# Altium schematic sheet RC_Sheet1.SchDoc
size A4
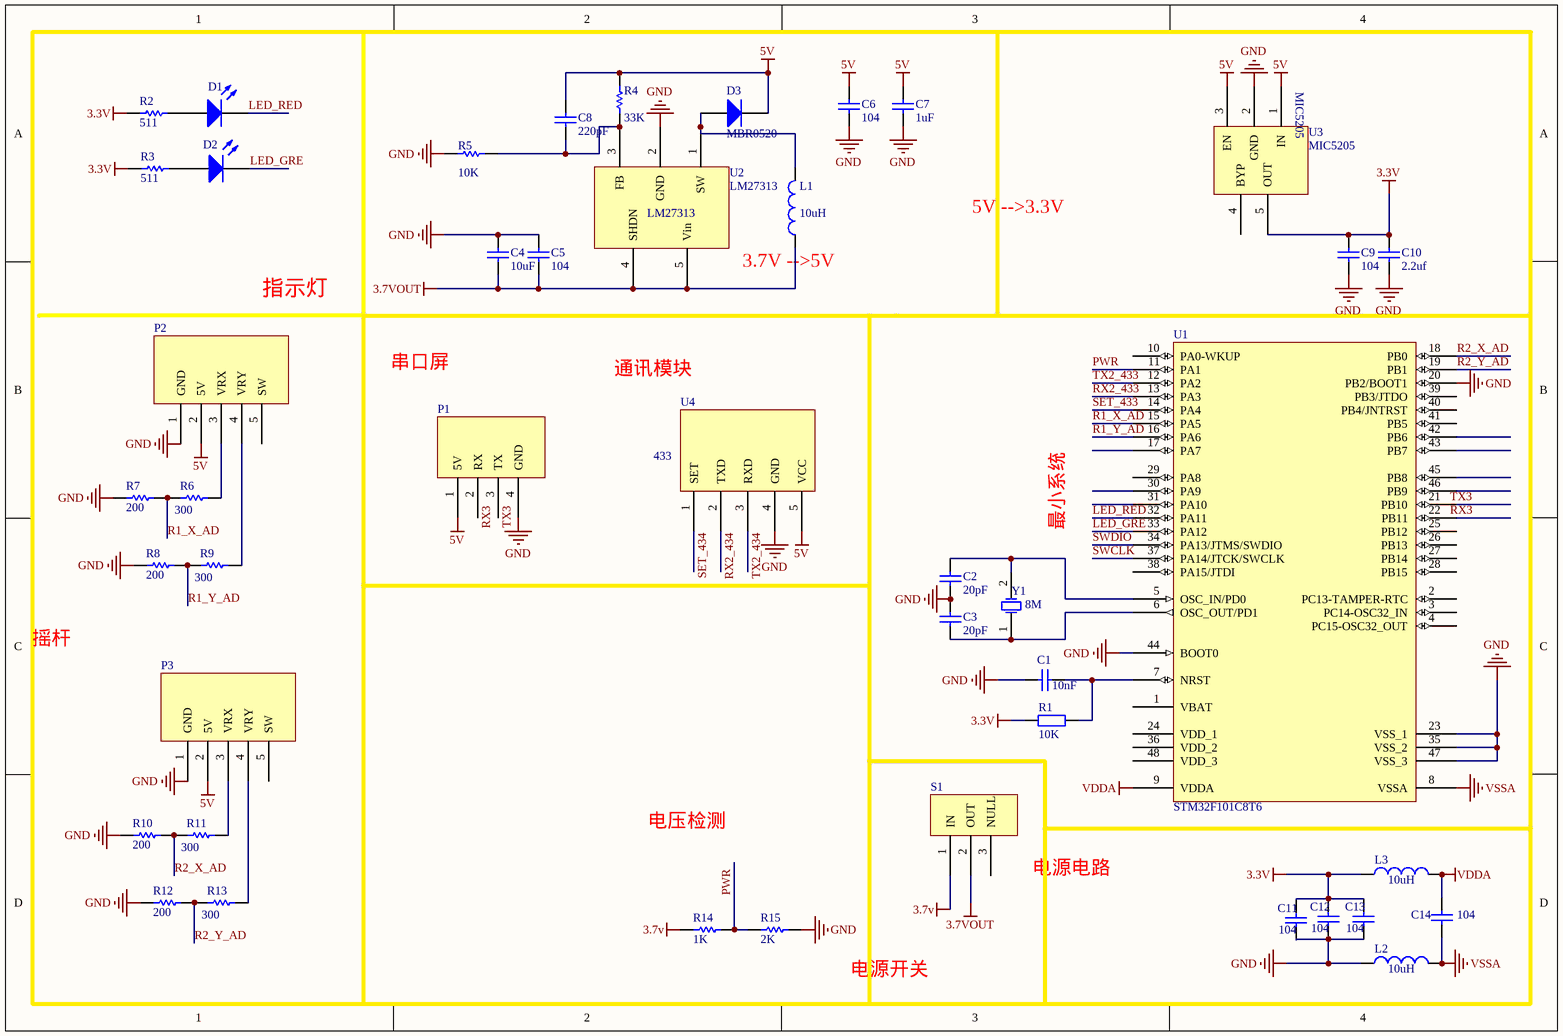
[diagram p0: RC_Sheet1.SchDoc]

## Parts
C1  value 10nF  [0603-N-CAP]  (hidden comment: Cap)
C2  value 20pF  [0603-N-CAP]  (hidden comment: Cap)
C3  value 20pF  [0603-N-CAP]  (hidden comment: Cap)
C4  value 10uF  [0603-N-CAP]  (hidden comment: Cap)
C5  value 104  [0603-N-CAP]  (hidden comment: Cap)
C6  value 104  [0603-N-CAP]  (hidden comment: Cap)
C7  value 1uF  [0603-N-CAP]  (hidden comment: Cap)
C8  value 220pF  [0603-N-CAP]  (hidden comment: Cap)
C9  value 104  [0603-N-CAP]  (hidden comment: Cap)
C10  value 2.2uf  [0603-N-CAP]  (hidden comment: Cap)
C11  value 104  [0603-N-CAP]  (hidden comment: Cap)
C12  value 104  [0603-N-CAP]  (hidden comment: Cap)
C13  value 104  [0603-N-CAP]  (hidden comment: Cap)
C14  value 104  [0603-N-CAP]  (hidden comment: Cap)
D1  D2  [0603-N - LED-RED]  (value not drawn)
D2  D2  [0603-N - LED-RED]  (value not drawn)
D3  MBR0520  [425]
L1  value 10uH  [0603-N - res]  (hidden comment: Inductor)
L2  value 10uH  [0603-N - res]  (hidden comment: Inductor)
L3  value 10uH  [0603-N - res]  (hidden comment: Inductor)
P1  串口屏  (value not drawn)
P2  手柄  (value not drawn)
P3  手柄  (value not drawn)
R1  value 10K  [0603-N - res]  (hidden comment: Res2)
R2  value 511  [0603-N - res]  (hidden comment: Res1)
R3  value 511  [0603-N - res]  (hidden comment: Res1)
R4  value 33K  [0603-N - res]  (hidden comment: Res1)
R5  value 10K  [0603-N - res]  (hidden comment: Res1)
R6  value 300  [0603-N - res]  (hidden comment: Res1)
R7  value 200  [0603-N - res]  (hidden comment: Res1)
R8  value 200  [0603-N - res]  (hidden comment: Res1)
R9  value 300  [0603-N - res]  (hidden comment: Res1)
R10  value 200  [0603-N - res]  (hidden comment: Res1)
R11  value 300  [0603-N - res]  (hidden comment: Res1)
R12  value 200  [0603-N - res]  (hidden comment: Res1)
R13  value 300  [0603-N - res]  (hidden comment: Res1)
R14  value 1K  [0603-N - res]  (hidden comment: Res1)
R15  value 2K  [0603-N - res]  (hidden comment: Res1)
S1  switch  [SWITCH]  (value not drawn)
U1  STM32F101C8T6  [LQFP48_N]
U2  LM27313  [SOT-23_5-001]
U3  MIC5205  [SOT-23_5-001]
U4  433  [433]
Y1  8M  [5032_]

## Nets
3.3V: C9.2 C10.2 C11.2 C12.2 C13.2 L3.1 R1.1 R2.2 R3.2 U3.5(OUT)
3.7v: R14.1 S1.1(IN)
3.7VOUT: C4.1 C5.1 L1.1 S1.2(OUT) U2.4(SHDN) U2.5(Vin)
5V: C6.2 C7.2 C8.2 D3.2(K) P1.1(5V) P2.2(5V) P3.2(5V) R4.2 U3.1(IN) U3.3(EN) U4.5(VCC)
GND: C1.1 C2.1 C3.2 C4.2 C5.2 C6.1 C7.1 C9.1 C10.1 C11.1 C12.1 C13.1 L2.1 P1.4(GND) P2.1(GND) P3.1(GND) R5.1 R7.2 R8.2 R10.2 R12.2 R15.2 U1.20(PB2/BOOT1) U1.23(VSS_1) U1.35(VSS_2) U1.44(BOOT0) U1.47(VSS_3) U2.2(GND) U3.2(GND) U4.4(GND)
VDDA: C14.2 L3.2 U1.9(VDDA)
VSSA: C14.1 L2.2 U1.8(VSSA)
LED_GRE: D2.2(K) U1.33(PA12)
LED_RED: D1.2(K) U1.32(PA11)
PWR: R14.2 R15.1 U1.11(PA1)
R1_X_AD: R6.2 R7.1 U1.15(PA5)
R1_Y_AD: R8.1 R9.2 U1.16(PA6)
R2_X_AD: R10.1 R11.2 U1.18(PB0)
R2_Y_AD: R12.1 R13.2 U1.19(PB1)
RX2_433: U1.13(PA3)
RX2_434: U4.2(TXD)
SET_433: U1.14(PA4)
SET_434: U4.1(SET)
SWCLK: U1.37(PA14/JTCK/SWCLK)
SWDIO: U1.34(PA13/JTMS/SWDIO)
TX2_433: U1.12(PA2)
TX2_434: U4.3(RXD)
NetC1_2: C1.2 R1.2 U1.7(NRST)
NetC2_2: C2.2 U1.5(OSC_IN/PD0) Y1.2(OSC2)
NetC3_1: C3.1 U1.6(OSC_OUT/PD1) Y1.1(OSC1)
NetC8_1: C8.1 R4.1 R5.2 U2.3(FB)
NetD1_1: D1.1(A) R2.1
NetD2_1: D2.1(A) R3.1
NetD3_1: D3.1(A) L1.2 U2.1(SW)
NetP2_3: P2.3(VRX) R6.1
NetP2_4: P2.4(VRY) R9.1
NetP3_3: P3.3(VRX) R11.1
NetP3_4: P3.4(VRY) R13.1

Not connected (* = marked no-connect by the designer): P1 2(RX) 3(TX); P2 5(SW); P3 5(SW); S1 3(NULL); U1 1(VBAT) 2(PC13-TAMPER-RTC) 3(PC14-OSC32_IN) 4(PC15-OSC32_OUT) 10(PA0-WKUP) 17(PA7) 21(PB10) 22(PB11) 24(VDD_1) 25(PB12) 26(PB13) 27(PB14) 28(PB15) 29(PA8) 30(PA9) 31(PA10) 36(VDD_2) 38(PA15/JTDI) 39(PB3/JTDO) 40(PB4/JNTRST) 41(PB5) 42(PB6) 43(PB7) 45(PB8) 46(PB9) 48(VDD_3); U3 4(BYP)

## Notes on the sheet
- (near L1) 3.7V -->5V
- 5V -->3.3V
- 指示灯
- 串口屏
- 通讯模块
- 最小系统
- 摇杆
- 电压检测
- 电源电路
- 电源开关
- Labels drawn without touching a wire or pin: RX3, TX3

## Library data of the parts
C1-C14 = Cap: Capacitor; Published: 8-Jun-2000; LatestRevisionDate: 17-Jul-2002; LatestRevisionNote: Re-released for DXP Platform.; PackageReference: RAD-0.3; Publisher: Altium Limited
D1 D2 = LED3: Typical BLUE SiC LED; Published: 8-Jun-2000; LatestRevisionDate: 17-Dec-2003; LatestRevisionNote: PCB Footprint replaced.; DatasheetDocument: 16-Apr-2002; PackageDocument: 16-Apr-2002; PackageReference: 3.5X2.8X1.9; Publisher: Altium Limited
D3 = Diode: Default Diode; Published: 8-Jun-2000; LatestRevisionDate: 17-Jul-2002; LatestRevisionNote: Re-released for DXP Platform.; PackageVersion: Sep-1996; PackageReference: SMC; Publisher: Altium Limited; PackageDescription: DO-214-AB/SMC; 2 C-Bend Leads; Body 7.9 x 5.9 mm, inc. leads (LxW); Code_JEDEC: DO-214-AB
L1-L3 = Inductor: Code_IEC: 1005; Published: 8-Jun-2000; PackageReference: 0402-A; Publisher: Altium Limited; Code_JEITA: 0402
  L1: LatestRevisionDate: 29-May-2009; LatestRevisionNote: IPC-7351 Footprint Added.; PackageDescription: Chip Inductor
  L2 L3: LatestRevisionDate: 17-Jul-2002; LatestRevisionNote: Re-released for DXP Platform.
R1 = Res2: Resistor; Published: 8-Jun-2000; LatestRevisionDate: 17-Jul-2002; LatestRevisionNote: Re-released for DXP Platform.; PackageReference: AXIAL-0.4; Publisher: Altium Limited
R2-R15 = Res1: Resistor; Published: 8-Jun-2000; LatestRevisionDate: 17-Jul-2002; LatestRevisionNote: Re-released for DXP Platform.; PackageReference: AXIAL-0.3; Publisher: Altium Limited; PackageDescription: Axial Device, Thru-Hole; 2 Leads; 0.3 in Pin Spacing
U1 = STM32F101C8T6: STM32 ARM-based 32-bit MCU with 64 Kbytes Flash, 48-pin LQFP, Industrial Temperature; Published: 30-May-2008; DatasheetVersion: rev6, Mar-2008; PackageVersion: Mar-2008; PackageReference: LQFP48; Publisher: Altium Limited; PackageDescription: 48-Pin Low-Profile Quad Flat Pack, 7 x 7 mm Body, 0.5 mm Pitch (LQFP48); ComponentLink1Description: Manufacturer Link; ComponentLink1URL: www.st.com/stm32; ComponentLink2Description: Datasheet; ComponentLink2URL: http://www.st.com/stonline/products/literature/ds/13586.pdf
U2 = LM27313: 3.7V升压到5v
U3 = MIC5205: 5V降压到3.3V
U4 = 433: 通讯模块
Y1 = XTAL: Crystal Oscillator; pin to pad: 2>3; Published: 8-Jun-2000; LatestRevisionDate: 17-Jul-2002; LatestRevisionNote: Re-released for DXP Platform.; PackageReference: R38; Publisher: Altium Limited